# Altium schematic sheet V1.2-核心板.SchDoc
size 609 x 355 mm; SheetTotal: 3
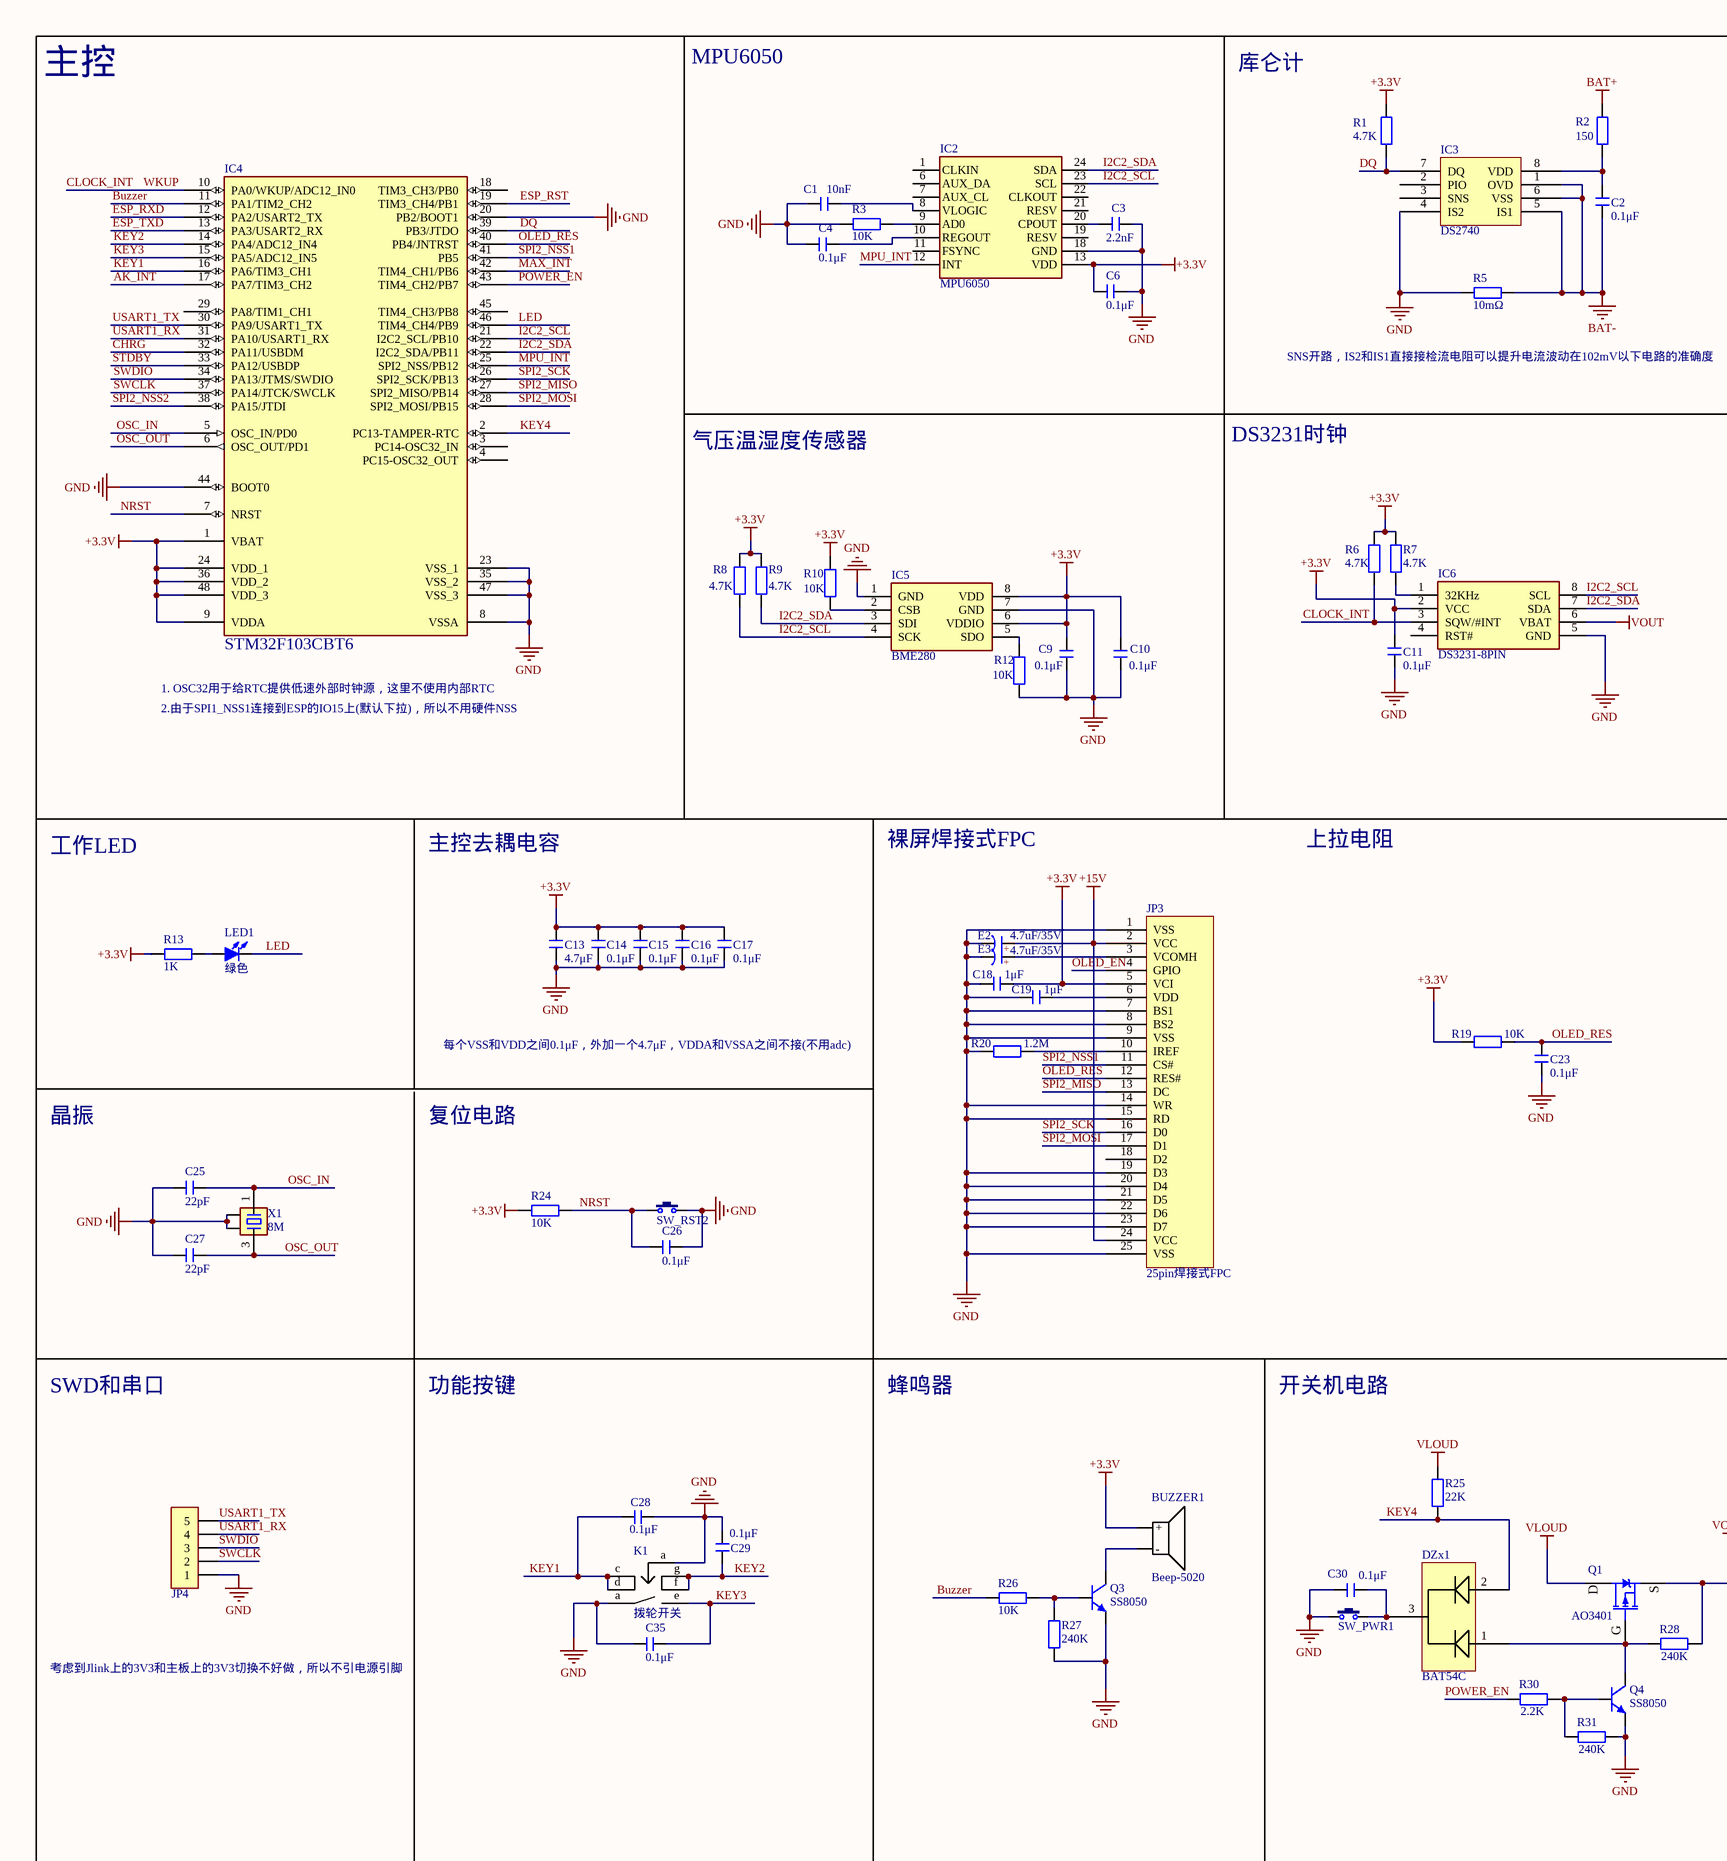
[diagram p0: V1.2-核心板.SchDoc, left]
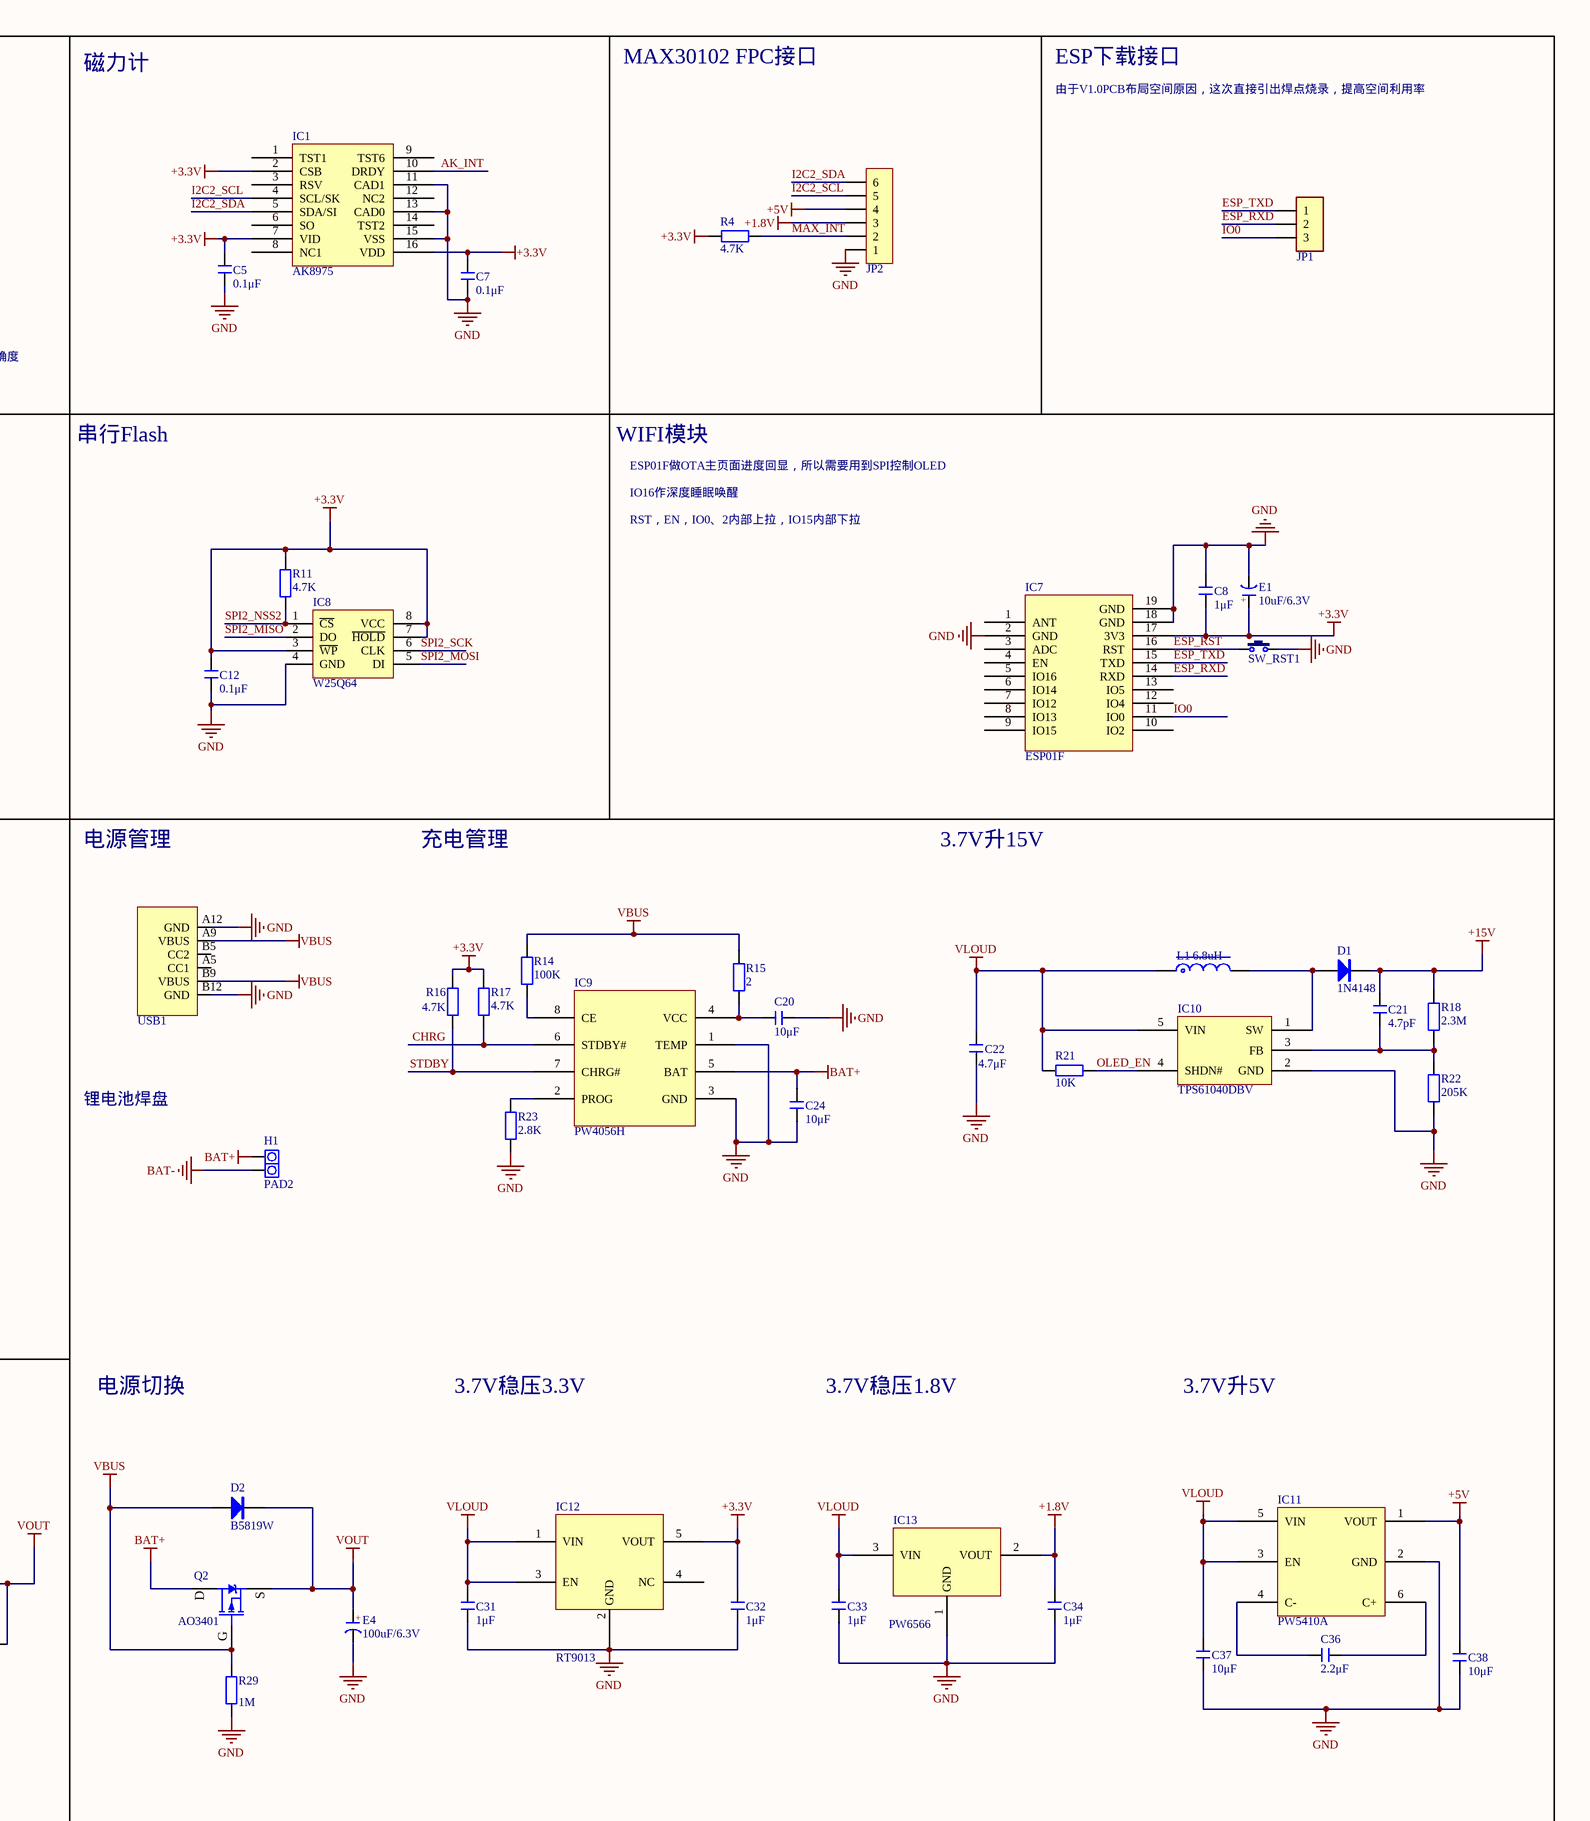
[diagram p1: V1.2-核心板.SchDoc, right]

## Parts
BUZZER1  Beep-5020  [5020BUZZER]
C1  10nF  [C 0603_L]
C2  0.1μF  [C 0603_L]
C3  2.2nF  [C 0603_L]
C4  0.1μF  [C 0603_L]
C5  0.1μF  [C 0603_L]
C6  0.1μF  [C 0603_L]
C7  0.1μF  [C 0603_L]
C8  1μF  [C 0603_L]
C9  0.1μF  [C 0603_L]
C10  0.1μF  [C 0603_L]
C11  0.1μF  [C 0603_L]
C12  0.1μF  [C 0603_L]
C13  4.7μF  [C 0603_L]
C14  0.1μF  [C 0603_L]
C15  0.1μF  [C 0603_L]
C16  0.1μF  [C 0603_L]
C17  0.1μF  [C 0603_L]
C18  1μF  [C 0603_L]
C19  1μF  [C 0603_L]
C20  10μF  [C 0603_L]
C21  4.7pF  [C 0603_L]
C22  4.7μF  [C 0603_L]
C23  0.1μF  [C 0603_L]
C24  10μF  [C 0603_L]
C25  22pF  [C 0603_L]
C26  0.1μF  [C 0603_L]
C27  22pF  [C 0603_L]
C28  0.1μF  [C 0603_L]
C29  0.1μF  [C 0603_L]
C30  0.1μF  [C 0603_L]
C31  1μF  [C 0603_L]
C32  1μF  [C 0603_L]
C33  1μF  [C 0603_L]
C34  1μF  [C 0603_L]
C35  0.1μF  [C 0603_L]
C36  2.2μF  [C 0603_L]
C37  10μF  [C 0603_L]
C38  10μF  [C 0603_L]
D1  1N4148  [SOD-123]
D2  B5819W  [SOD-123]
DZx1  BAT54C  [SOT23-3N]
E1  10uF/6.3V  [CD A(3216)]
E2  4.7uF/35V  [CD A(3216)]
E3  4.7uF/35V  [CD A(3216)]
E4  100uF/6.3V  [CD A(3216)]
H1  PAD2  [CHARGE_PAD]
IC1  AK8975  [QFN16 4x4_M]
IC2  MPU6050  [QFN24 4x4_M]
IC3  DS2740  [MSOP8_L]
IC4  STM32F103CBT6  [LQFP48 7X7_M]
IC5  BME280  [BME280]
IC6  DS3231-8PIN  [SOP8_N]
IC7  ESP01F  [ESP-01F]
IC8  W25Q64  [SOP8W_N]
IC9  PW4056H  [SOP-8_L4.9-W3.9-P1.27-LS6.0-BL-EP3.1]
IC10  TPS61040DBV  [SOT23-5L]
IC11  PW5410A  [SOT23-6]
IC12  RT9013  [SOT23-5L]
IC13  PW6566  [SOT23-3L]
JP1  HDR-1X3  [TEST_POINT_3]  (value not drawn)
JP2  FPC1.0-6P  [FPC0.5 2H-WS-6P]  (value not drawn)
JP3  25pin焊接式FPC  [25pin焊接式FPC]
JP4  HDR-1X5  [TEST_POINT_5]  (value not drawn)
K1  拨轮开关  [拨轮开关]
L1  6.8uH  [NR3015]
LED1  绿色  [LED 0603G]
Q1  AO3401  [SOT23-3N]
Q2  AO3401  [SOT23-3N]
Q3  SS8050  [SOT23-3N]
Q4  SS8050  [SOT23-3N]
R1  4.7K  [R 0603_L]
R2  150  [R 0603_L]
R3  10K  [R 0603_L]
R4  4.7K  [R 0603_L]
R5  10mΩ  [R 0603_L]
R6  4.7K  [R 0603_L]
R7  4.7K  [R 0603_L]
R8  4.7K  [R 0603_L]
R9  4.7K  [R 0603_L]
R10  10K  [R 0603_L]
R11  4.7K  [R 0603_L]
R12  10K  [R 0603_L]
R13  1K  [R 0603_L]
R14  100K  [R 0603_L]
R15  2  [R 0603_L]
R16  4.7K  [R 0603_L]
R17  4.7K  [R 0603_L]
R18  2.3M  [R 0603_L]
R19  10K  [R 0603_L]
R20  1.2M  [R 0603_L]
R21  10K  [R 0603_L]
R22  205K  [R 0603_L]
R23  2.8K  [R 0603_L]
R24  10K  [R 0603_L]
R25  22K  [R 0603_L]
R26  10K  [R 0603_L]
R27  240K  [R 0603_L]
R28  240K  [R 0603_L]
R29  1M  [R 0603_L]
R30  2.2K  [R 0603_L]
R31  240K  [R 0603_L]
SW_PWR1  3  [KEY-SMD_UK-B0264-SP25Y]  (value not drawn)
SW_RST1  3x4x2  [SW-SMD_L4.0-W3.0-LS4.6]  (value not drawn)
SW_RST2  3x4x2  [SW-SMD_L4.0-W3.0-LS4.6]  (value not drawn)
USB1  918-418K2023S40006  [USB-C-SMD_918-418K2023S40006]  (value not drawn)
X1  8M  [OSC 3225-4P]

## Blocks framed on the sheet
主控: IC4

## Nets
+1.8V: C34.1 IC13.2(VOUT) JP2.3
+3.3V: BUZZER1.1(+) C5.2 C6.2 C7.2 C8.1 C9.1 C10.1 C11.1 C12.2 C13.2 C14.2 C15.2 C16.2 C17.2 C18.2 C32.1 E1.1(A) IC1.2(CSB) IC1.7(VID) IC1.16(VDD) IC2.13(VDD) IC4.1(VBAT) IC4.9(VDDA) IC4.24(VDD_1) IC4.36(VDD_2) IC4.48(VDD_3) IC5.6(VDDIO) IC5.8(VDD) IC6.2(VCC) IC7.17(3V3) IC8.3(~{WP}) IC8.7(~{HOLD}) IC8.8(VCC) IC12.5(VOUT) JP3.5(VCI) R1.2 R4.2 R6.1 R7.1 R8.1 R9.1 R10.2 R11.2 R13.2 R16.2 R17.2 R19.1 R24.2
+5V: C38.1 IC11.1(VOUT) JP2.4
+15V: C21.2 D1.2(K) E2.1(A) JP3.2(VCC) JP3.24(VCC) R18.2
BAT+: C24.1 H1.+ IC9.5(BAT) Q2.3(D) R2.2
BAT-: C2.1 H1.- IC3.1(OVD) IC3.5(IS1) IC3.6(VSS) R5.1
GND: C1.2 C3.1 C4.2 C5.1 C6.1 C7.1 C8.2 C9.2 C10.2 C11.2 C12.1 C13.1 C14.1 C15.1 C16.1 C17.1 C18.1 C19.1 C20.1 C22.1 C23.1 C24.2 C25.2 C26.1 C27.2 C28.2 C29.2 C30.1 C31.2 C32.2 C33.2 C34.2 C35.2 C37.1 C38.2 E1.2(K) E2.2(K) E3.2(K) E4.2(K) IC1.11(CAD1) IC1.13(CAD0) IC1.15(VSS) IC2.18(GND) IC3.4(IS2) IC4.8(VSSA) IC4.20(PB2/BOOT1) IC4.23(VSS_1) IC4.35(VSS_2) IC4.44(BOOT0) IC4.47(VSS_3) IC5.1(GND) IC5.7(GND) IC6.5(GND) IC7.2(GND) IC7.18(GND) IC7.19(GND) IC8.4(GND) IC9.1(TEMP) IC9.3(GND) IC10.2(GND) IC11.2(GND) IC12.2(GND) IC13.1(GND) JP2.1 JP3.1(VSS) JP3.7(BS1) JP3.8(BS2) JP3.9(VSS) JP3.14(WR) JP3.15(RD) JP3.19(D3) JP3.20(D4) JP3.21(D5) JP3.22(D6) JP3.23(D7) JP3.25(VSS) JP4.1 K1.a Q3.2(E) Q4.2(E) R3.2 R5.2 R12.1 R20.1 R22.1 R23.1 R27.1 R29.2 R31.1 SW_PWR1.2 SW_RST1.2 SW_RST2.2 USB1.A12(GND) USB1.B12(GND) X1.2 X1.4
VBUS: D2.1(A) Q2.1(G) R14.2 R15.2 R29.1 USB1.A9(VBUS) USB1.B9(VBUS)
VLOUD: C22.2 C31.1 C33.1 C37.2 IC10.5(VIN) IC11.3(EN) IC11.5(VIN) IC12.1(VIN) IC12.3(EN) IC13.3(VIN) L1.1 Q1.3(D) R21.2 R25.1
VOUT: D2.2(K) E4.1(A) IC6.6(VBAT) Q1.2(S) Q2.2(S) R28.1
AK_INT: IC1.10(DRDY) IC4.17(PA7/TIM3_CH2)
Buzzer: IC4.11(PA1/TIM2_CH2) R26.1
CHRG: IC4.32(PA11/USBDM) IC9.6(STDBY#) R17.1
CLOCK_INT: IC4.10(PA0/WKUP/ADC12_IN0) IC6.3(SQW/#INT) R6.2  [also labelled WKUP]
DQ: IC3.7(DQ) IC4.39(PB3/JTDO) R1.1
ESP_RST: IC4.19(TIM3_CH4/PB1) IC7.16(RST) SW_RST1.1
ESP_RXD: IC4.12(PA2/USART2_TX) IC7.14(RXD) JP1.2
ESP_TXD: IC4.13(PA3/USART2_RX) IC7.15(TXD) JP1.1
I2C2_SCL: IC1.4(SCL/SK) IC2.23(SCL) IC4.21(I2C2_SCL/PB10) IC5.4(SCK) IC6.8(SCL) JP2.5 R8.2
I2C2_SDA: IC1.5(SDA/SI) IC2.24(SDA) IC4.22(I2C2_SDA/PB11) IC5.3(SDI) IC6.7(SDA) JP2.6 R9.2
IO0: IC7.11(IO0) JP1.3
KEY1: C28.1 IC4.16(PA6/TIM3_CH1) K1.c K1.d
KEY2: C29.1 IC4.14(PA4/ADC12_IN4) K1.f K1.g
KEY3: C35.1 IC4.15(PA5/ADC12_IN5) K1.e
KEY4: DZx1.2 IC4.2(PC13-TAMPER-RTC) R25.2
LED: IC4.46(TIM4_CH4/PB9) LED1.2(K)
MAX_INT: IC4.42(TIM4_CH1/PB6) JP2.2 R4.1
MPU_INT: IC2.12(INT) IC4.25(SPI2_NSS/PB12)
NRST: C26.2 IC4.7(NRST) R24.1 SW_RST2.1
OLED_EN: IC10.4(SHDN#) JP3.4(GPIO) R21.1
OLED_RES: C23.2 IC4.40(PB4/JNTRST) JP3.12(RES#) R19.2
OSC_IN: C25.1 IC4.5(OSC_IN/PD0) X1.1
OSC_OUT: C27.1 IC4.6(OSC_OUT/PD1) X1.3
POWER_EN: IC4.43(TIM4_CH2/PB7) R30.2
SPI2_MISO: IC4.27(SPI2_MISO/PB14) IC8.2(DO) JP3.13(DC)
SPI2_MOSI: IC4.28(SPI2_MOSI/PB15) IC8.5(DI) JP3.17(D1)
SPI2_NSS1: IC4.41(PB5) JP3.11(CS#)
SPI2_NSS2: IC4.38(PA15/JTDI) IC8.1(~{CS}) R11.1
SPI2_SCK: IC4.26(SPI2_SCK/PB13) IC8.6(CLK) JP3.16(D0)
STDBY: IC4.33(PA12/USBDP) IC9.7(CHRG#) R16.1
SWCLK: IC4.37(PA14/JTCK/SWCLK) JP4.2
SWDIO: IC4.34(PA13/JTMS/SWDIO) JP4.3
USART1_RX: IC4.31(PA10/USART1_RX) JP4.4
USART1_TX: IC4.30(PA9/USART1_TX) JP4.5
NetBUZZER1_2: BUZZER1.2(-) Q3.3(C)
NetC1_1: C1.1 IC2.8(VLOGIC)
NetC2_2: C2.2 IC3.8(VDD) R2.1
NetC3_2: C3.2 IC2.20(CPOUT)
NetC4_1: C4.1 IC2.10(REGOUT)
NetC19_2: C19.2 JP3.6(VDD)
NetC20_2: C20.2 IC9.4(VCC) R15.1
NetC21_1: C21.1 IC10.3(FB) R18.1 R22.2
NetC30_2: C30.2 DZx1.3 SW_PWR1.1
NetC36_1: C36.1 IC11.6(C+)
NetC36_2: C36.2 IC11.4(C-)
NetD1_1: D1.1(A) IC10.1(SW) L1.2
NetDZx1_1: DZx1.1 Q1.1(G) Q4.3(C) R28.2
NetE3_1: E3.1(A) JP3.3(VCOMH)
NetIC2_9: IC2.9(AD0) R3.1
NetIC5_2: IC5.2(CSB) R10.1
NetIC5_5: IC5.5(SDO) R12.2
NetIC6_1: IC6.1(32KHz) R7.2
NetIC9_2: IC9.2(PROG) R23.2
NetIC9_8: IC9.8(CE) R14.1
NetJP3_10: JP3.10(IREF) R20.2
NetLED1_1: LED1.1(A) R13.1
NetQ3_1: Q3.1(B) R26.2 R27.2
NetQ4_1: Q4.1(B) R30.1 R31.2

Not connected (* = marked no-connect by the designer): IC1 1(TST1) 3(RSV) 6(SO) 8(NC1) 9(TST6) 12(NC2) 14(TST2); IC2 1(CLKIN) 6(AUX_DA) 7(AUX_CL) 11(FSYNC) 19(RESV) 21(RESV) 22(CLKOUT); IC3 2(PIO) 3(SNS); IC4 3(PC14-OSC32_IN) 4(PC15-OSC32_OUT) 18(TIM3_CH3/PB0) 29(PA8/TIM1_CH1) 45(TIM4_CH3/PB8); IC6 4(RST#); IC7 1(ANT) 3(ADC) 4(EN) 5(IO16) 6(IO14) 7(IO12) 8(IO13) 9(IO15) 10(IO2) 12(IO4) 13(IO5); IC12 4(NC); JP3 18(D2); USB1 A5(CC1) B5(CC2)

## Notes on the sheet
- MPU6050
- 库仑计
- 磁力计
- MAX30102 FPC接口
- ESP下载接口
- 由于V1.0PCB布局空间原因，这次直接引出焊点烧录，提高空间利用率
- SNS开路，IS2和IS1直接接检流电阻可以提升电流波动在102mV以下电路的准确度
- DS3231时钟
- 串行Flash
- WIFI模块
- 气压温湿度传感器
- IO16作深度睡眠唤醒
- ESP01F做OTA主页面进度回显，所以需要用到SPI控制OLED
- RST，EN，IO0、2内部上拉，IO15内部下拉
- 1. OSC32用于给RTC提供低速外部时钟源，这里不使用内部RTC
- 2.由于SPI1_NSS1连接到ESP的IO15上(默认下拉)，所以不用硬件NSS
- 裸屏焊接式FPC
- 上拉电阻
- 电源管理
- 充电管理
- 3.7V升15V
- 工作LED
- 主控去耦电容
- 每个VSS和VDD之间0.1μF，外加一个4.7μF，VDDA和VSSA之间不接(不用adc)
- 锂电池焊盘
- 晶振
- 复位电路
- SWD和串口
- 功能按键
- 蜂鸣器
- 开关机电路
- 电源切换
- 3.7V稳压3.3V
- 3.7V稳压1.8V
- 3.7V升5V
- 考虑到Jlink上的3V3和主板上的3V3切换不好做，所以不引电源引脚
- (in symbol C-CD) +

## Library data of the parts
BUZZER1 = Beep-5020: 贴片蜂鸣器5020最小封装
C1-C38 = C: 无极性贴片电容; 版权归属: 源创客; BOM名称: 无极性贴片电容; 学习资源: www.ooocke.com
D1 = 1N4148: 高速开关二极管; 版权归属: 源创客; BOM名称: 高速开关二极管; 学习资源: www.ooocke.com
D2 = B5819W: 肖特基二极管; BOM名称: 高速开关二极管; 版权归属: 源创客; 学习资源: www.ooocke.com
DZx1 = BAT54C: 双肖特基，共阴极
E1-E4 = C-CD: 贴片钽电容; 版权归属: 源创客; BOM名称: 贴片钽电容; 学习资源: www.ooocke.com
H1 = PAD2: 引线焊盘; 版权归属: 源创客; BOM名称: 引线焊盘; 学习资源: www.ooocke.com
IC1 = AK8975: 采用高灵敏度霍尔传感器技术的三轴电子罗盘IC。 / 最适合步行城市导航，用于手机和其他便携式设备
IC2 = MPU6050: 陀螺仪
IC3 = DS2740: 高精度库仑计
IC4 = STM32F103CB: Flash:128/RAM:20/IO:48; BOM名称: 32位STM单片机; 版权归属: 源创客; 学习资源: www.ooocke.com
IC5 = BME280: 气压，湿度，温度传感器
IC7 = ESP01F: ESP-01F WiFi 模块是由安信可科技开发的，该模块核心处理器 ESP8285 在较小尺寸封装中集成了业界领先的 Tensilica L106 超低功耗 32 位微型 MCU，带有 16 位精简模式，主频支持 80 MHz 和 160 MH，支持 RTOS，集成 Wi-Fi MAC/BB/RF/PA/LNA。ESP-01F WiFi 模块支持标准的 IEEE802.11 b/g/n 协议，完整的 TCP/IP 协议栈。用户可以使用该模块为现有的设备添加联网功能，也可以构建独立的网络控制器
IC8 = W25Qxx: 外置Flash; 版权归属: 源创客; BOM名称: 外置Flash; 学习资源: www.ooocke.com
IC9 = PW4056H: PW4056H 是一款完整的采用恒定电流/恒定电压的高压、大电流、单节鲤离子电池线性充电IC，最高耐压可达 28V，6.5V 自动过压保护，充电电流可达 1A。
IC10 = TPS61040DBV: 28V、400mA 开关升压转换器，适用于 LCD 和白光 LED
IC11 = PW5410A: 低噪声，恒频 1.2MHZ，输入电压范围2.7v-5v，5v固定输出电压，输出电流250mA的DCDC升压
IC12 = RT9013: RT9013是一款超低噪声、超低压差、超快速响应稳压器。它采用SOT23-5 (2.7mm X 1.4mm)/SC70-5( 1 8mm X 1.15mm )/DFN-6L( 2mm X 2mm )三种封装
IC13 = PW6566: PW6566 系列是使用 CMOS 技术开发的低压差，高精度 输出电压，低消耗电流正电压型电压稳压器
JP1 = Header 3: 3P接插件; 版权归属: 源创客; BOM名称: 3P接插件; 学习资源: www.ooocke.com
JP2 = FPC-6P: FPC连接器; 版权归属: 源创客; BOM名称: FPC连接器; 学习资源: www.ooocke.com
JP4 = Header 5: 5P接插件; 版权归属: 源创客; BOM名称: 5P接插件; 学习资源: www.ooocke.com
L1 = L-NR: NR磁胶电感; 版权归属: 源创客; BOM名称: NR磁胶电感; 学习资源: www.ooocke.com
LED1 = LED-SMD: 贴片LED; 版权归属: 源创客; BOM名称: 贴片LED; 学习资源: www.ooocke.com
Q1 Q2 = AO3401: P沟道场效应管; 版权归属: 源创客; BOM名称: P沟道场效应管; 学习资源: www.ooocke.com
Q3 Q4 = 8050-SMD: 高频放大-NPN型; 版权归属: 源创客; 属性: 40V 1.5A 1W 100MHZ; BOM名称: 高频放大-NPN型; 学习资源: www.ooocke.com
R1-R31 = R: 贴片电阻; 版权归属: 源创客; BOM名称: 贴片电阻; 学习资源: www.ooocke.com
SW_PWR1 = TSW 2x4x3.5: 2x4x3.5轻触开关; 版权归属: 源创客; BOM名称: 2x4x3.5轻触开关; 学习资源: www.ooocke.com
SW_RST1 SW_RST2 = TSW 3x4x2: 3x4x2开关; 版权归属: 源创客; BOM名称: 3x4x2开关; 学习资源: www.ooocke.com
USB1 = TYPE-C 6PIN: 连接器类型:Type-C;标准:USB 3.1;公母:母座;触点数量:6;端口数量:1;安装方式:卧贴;额定电流 - 电源:-;工作温度范围:-40℃~+85℃;; Manufacturer: 精拓金; Add into BOM: yes; Connector Type: Type-C; Gender: 母座; Number of Contacts: 6; Number of Ports: 1; Symbol: 918-418K2023S40006; Device: 918-418K2023S40006; LCSC Part Name: Type-C 母座 卧贴 无弹单排LCP黑胶; Supplier Part: C399925; Manufacturer Part: 918-418K2023S40006; Supplier Footprint: SMD; JLCPCB Part Class: Extended Part; Datasheet: https://atta.szlcsc.com/upload/public/pdf/source/20190620/C399925_D8B78B8101E8027AE7B71A8976357F30.pdf; Supplier: LCSC; Convert to PCB: yes; Standard: USB 3.1; Mounting Style: 卧贴; Current Rating - Power (Max): -; Operating Temperature Range: -40℃~+85℃
X1 = XTAL-4P: 4脚无源晶振; 版权归属: 源创客; BOM名称: 4脚无源晶振; 学习资源: www.ooocke.com